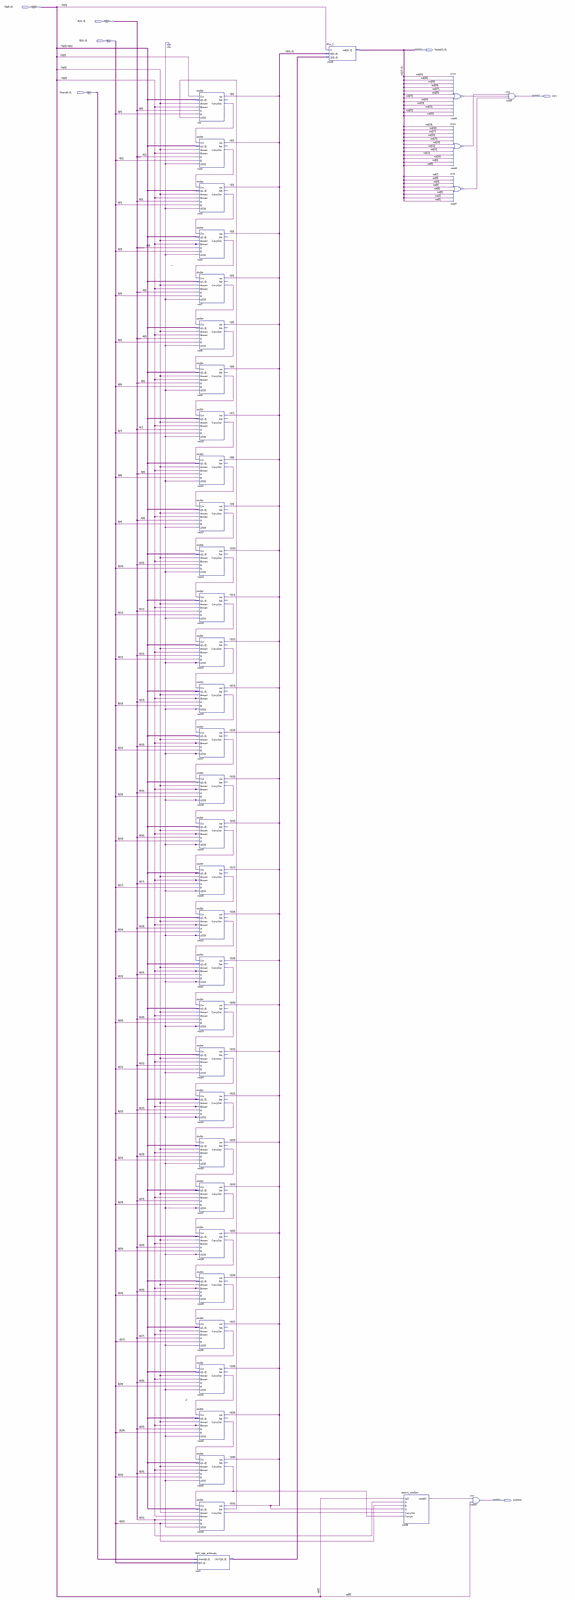
[diagram p0: schematic sheet, whole]
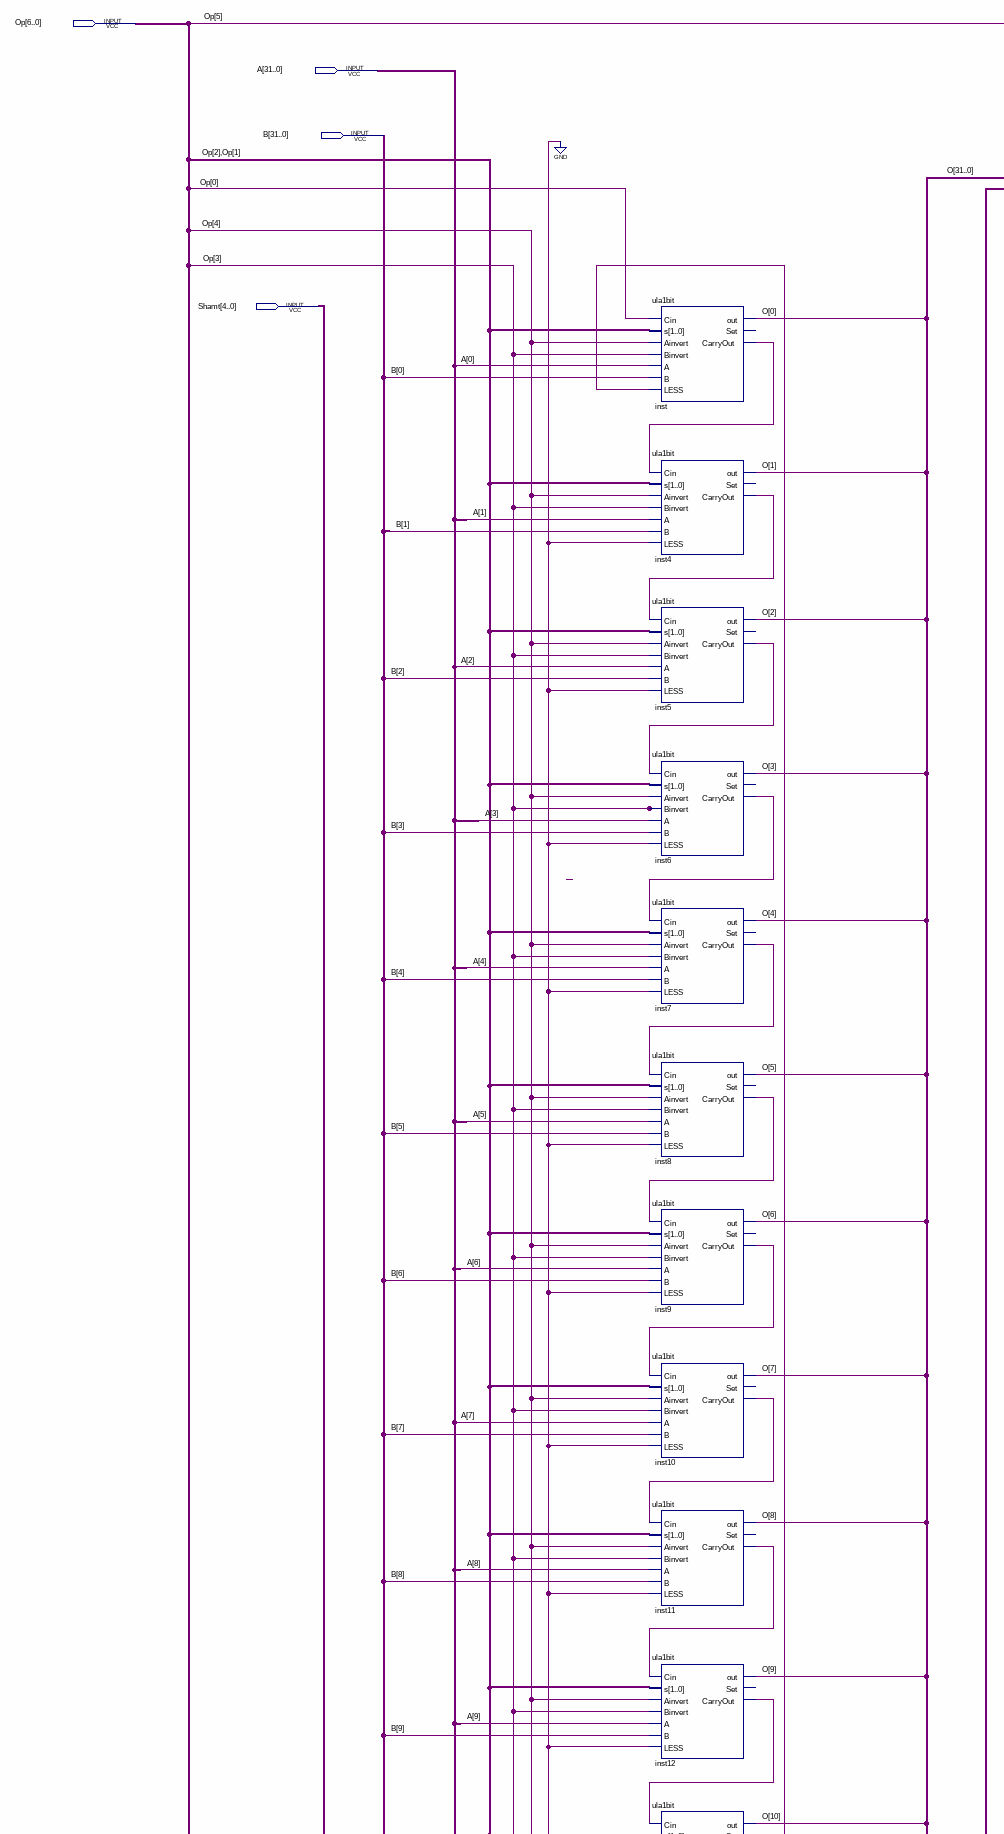
[diagram p1: schematic sheet, upper left part]
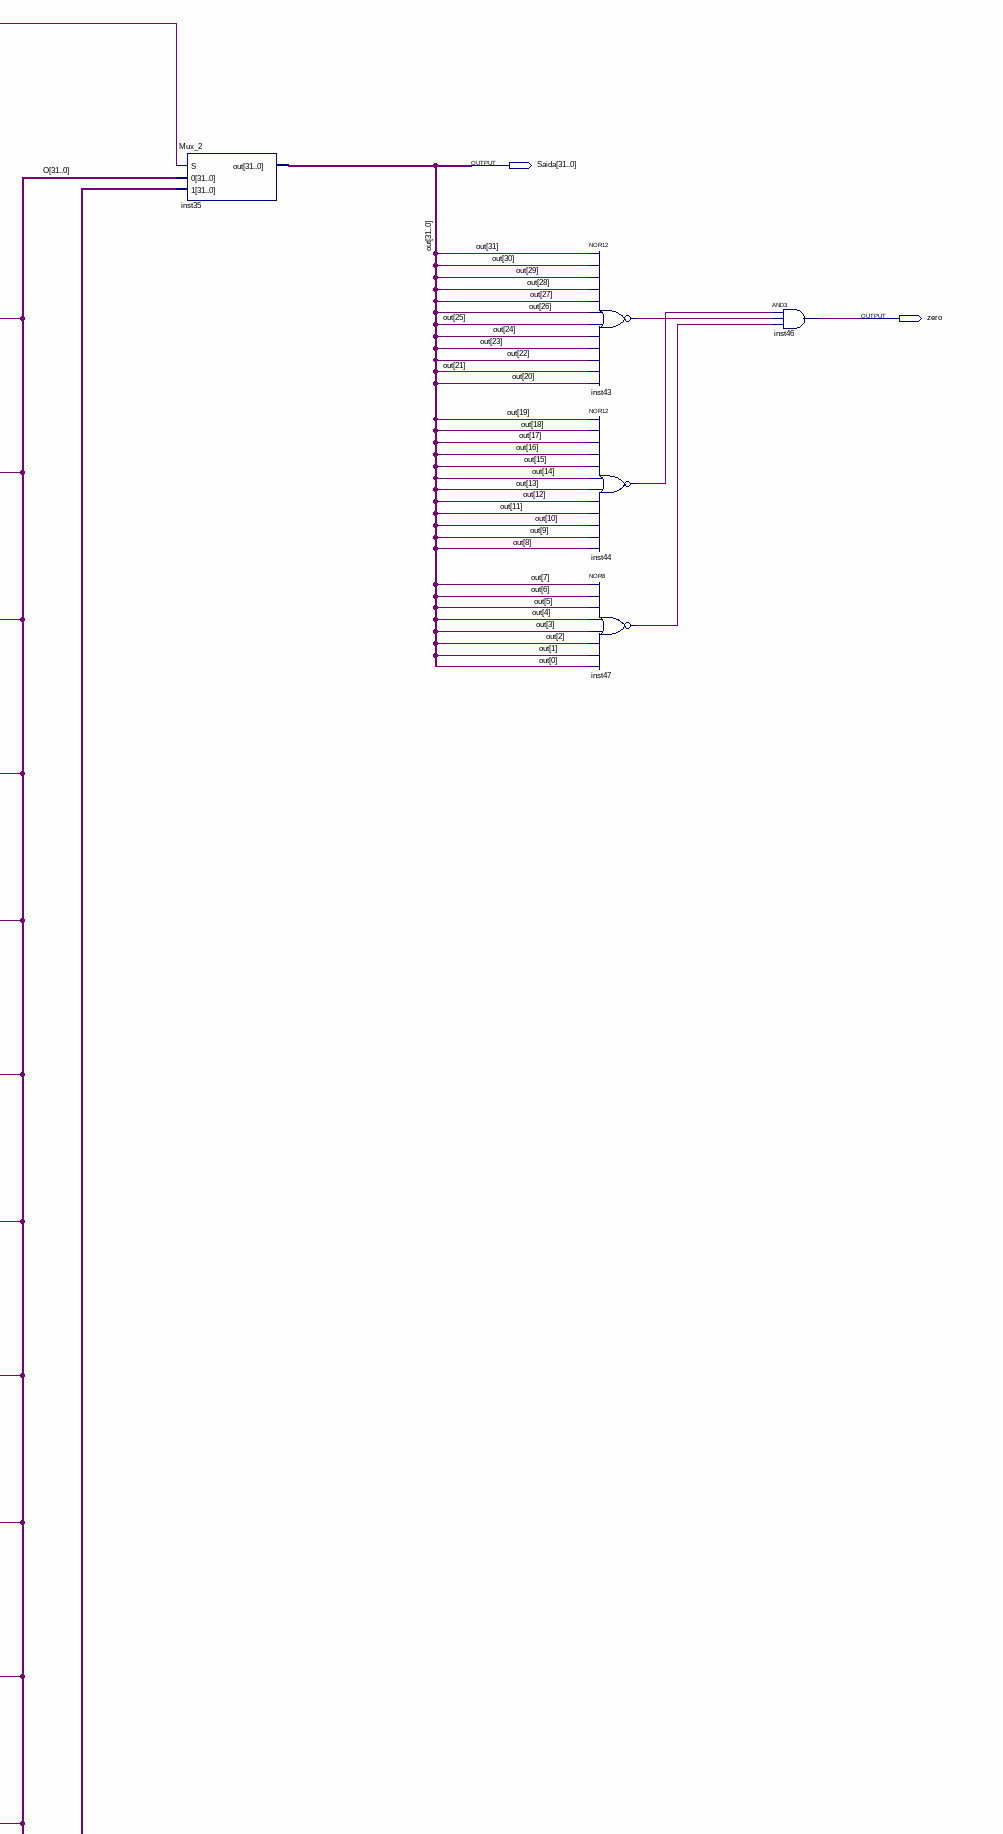
[diagram p2: schematic sheet, upper right part]
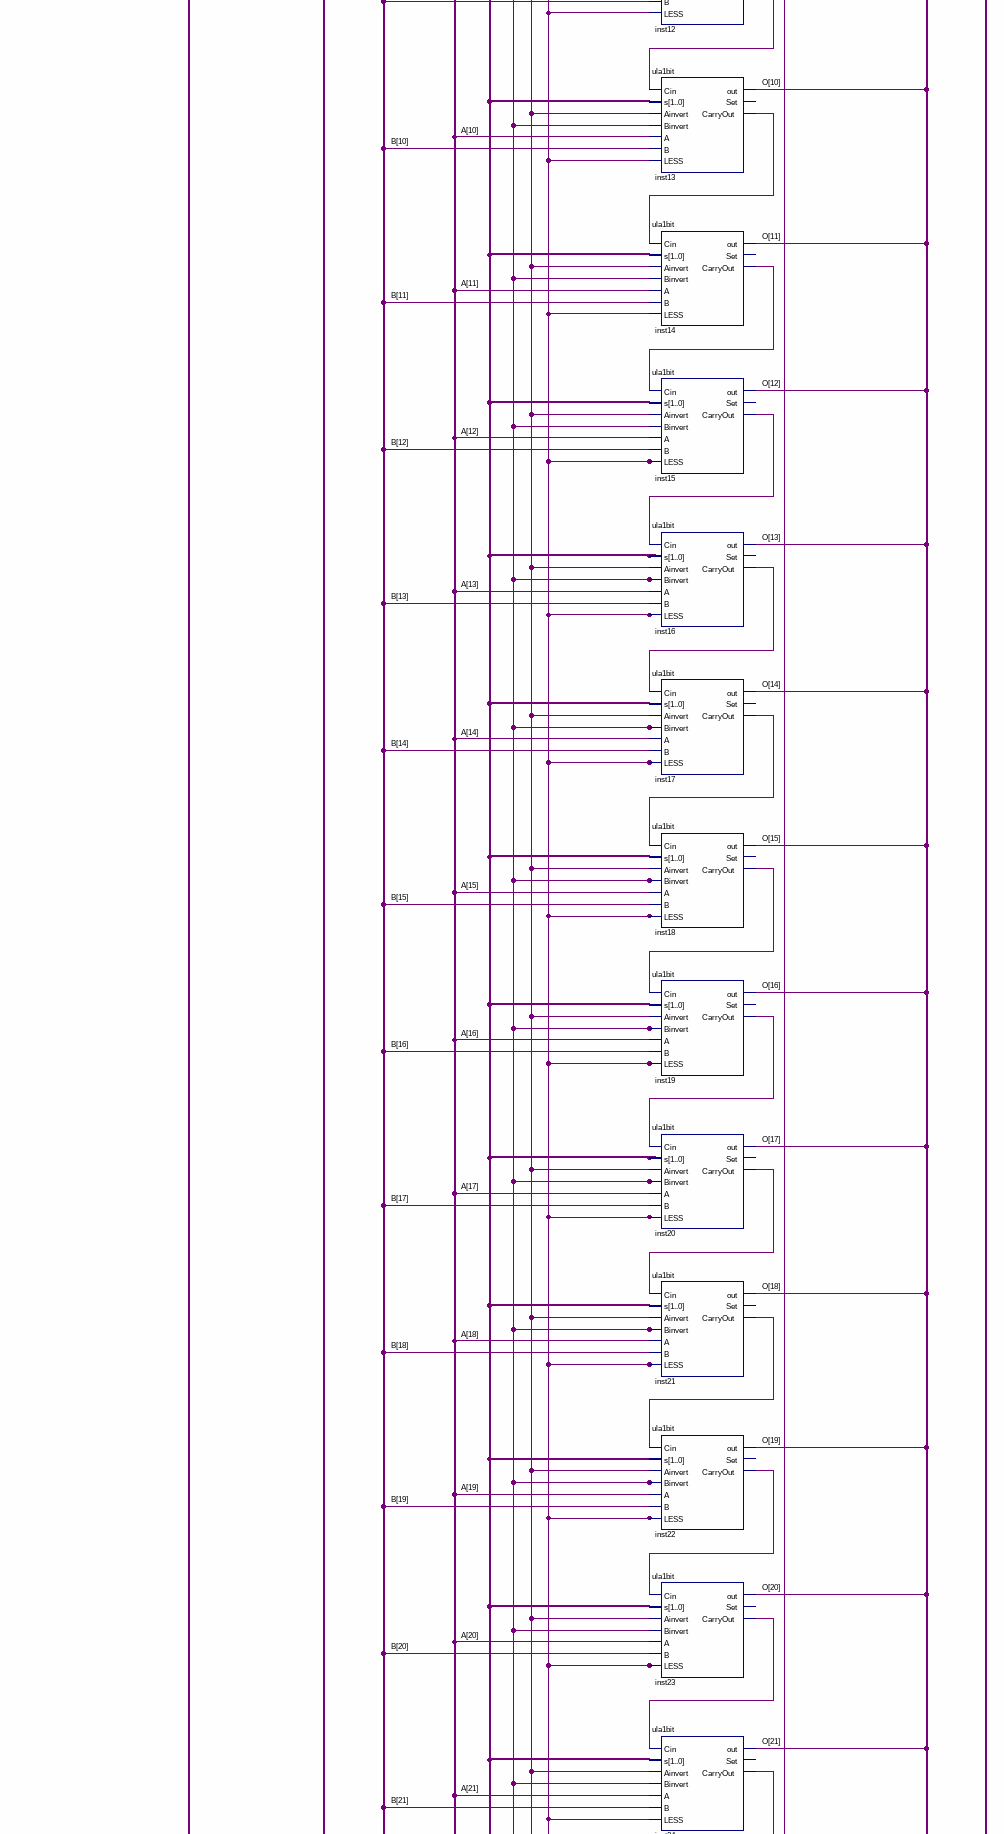
[diagram p3: schematic sheet, middle left part]
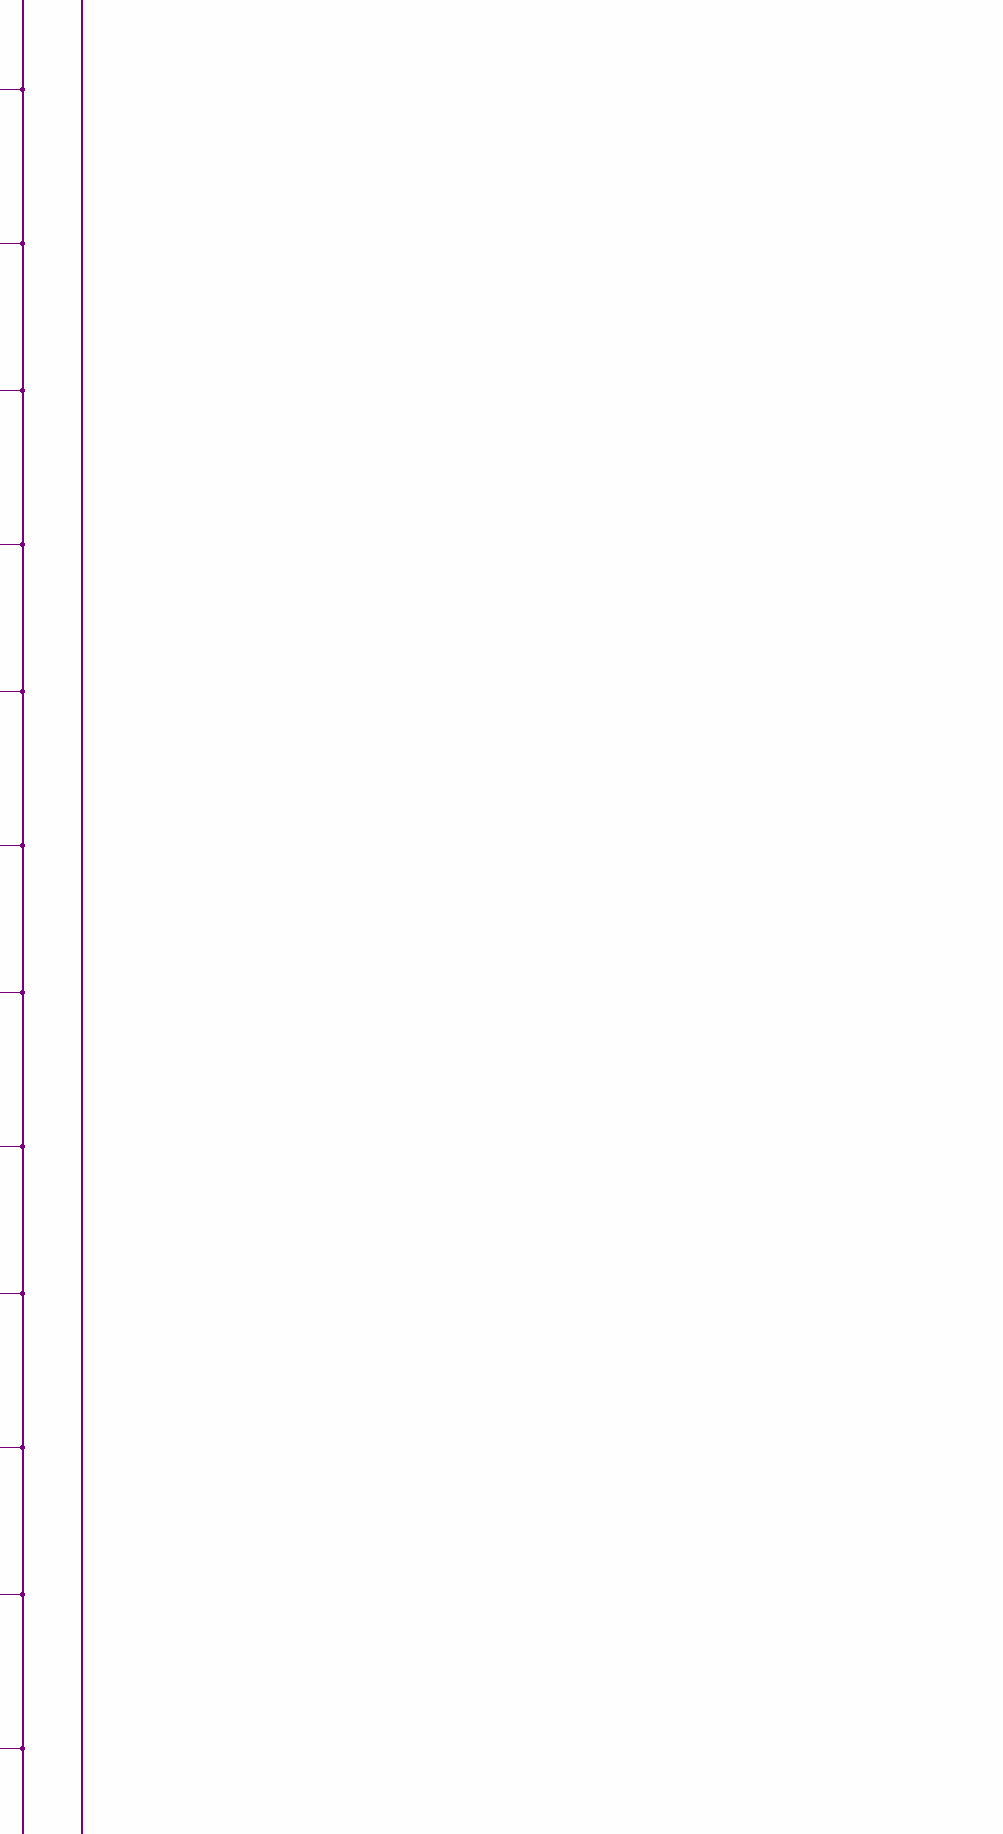
[diagram p4: schematic sheet, middle right part]
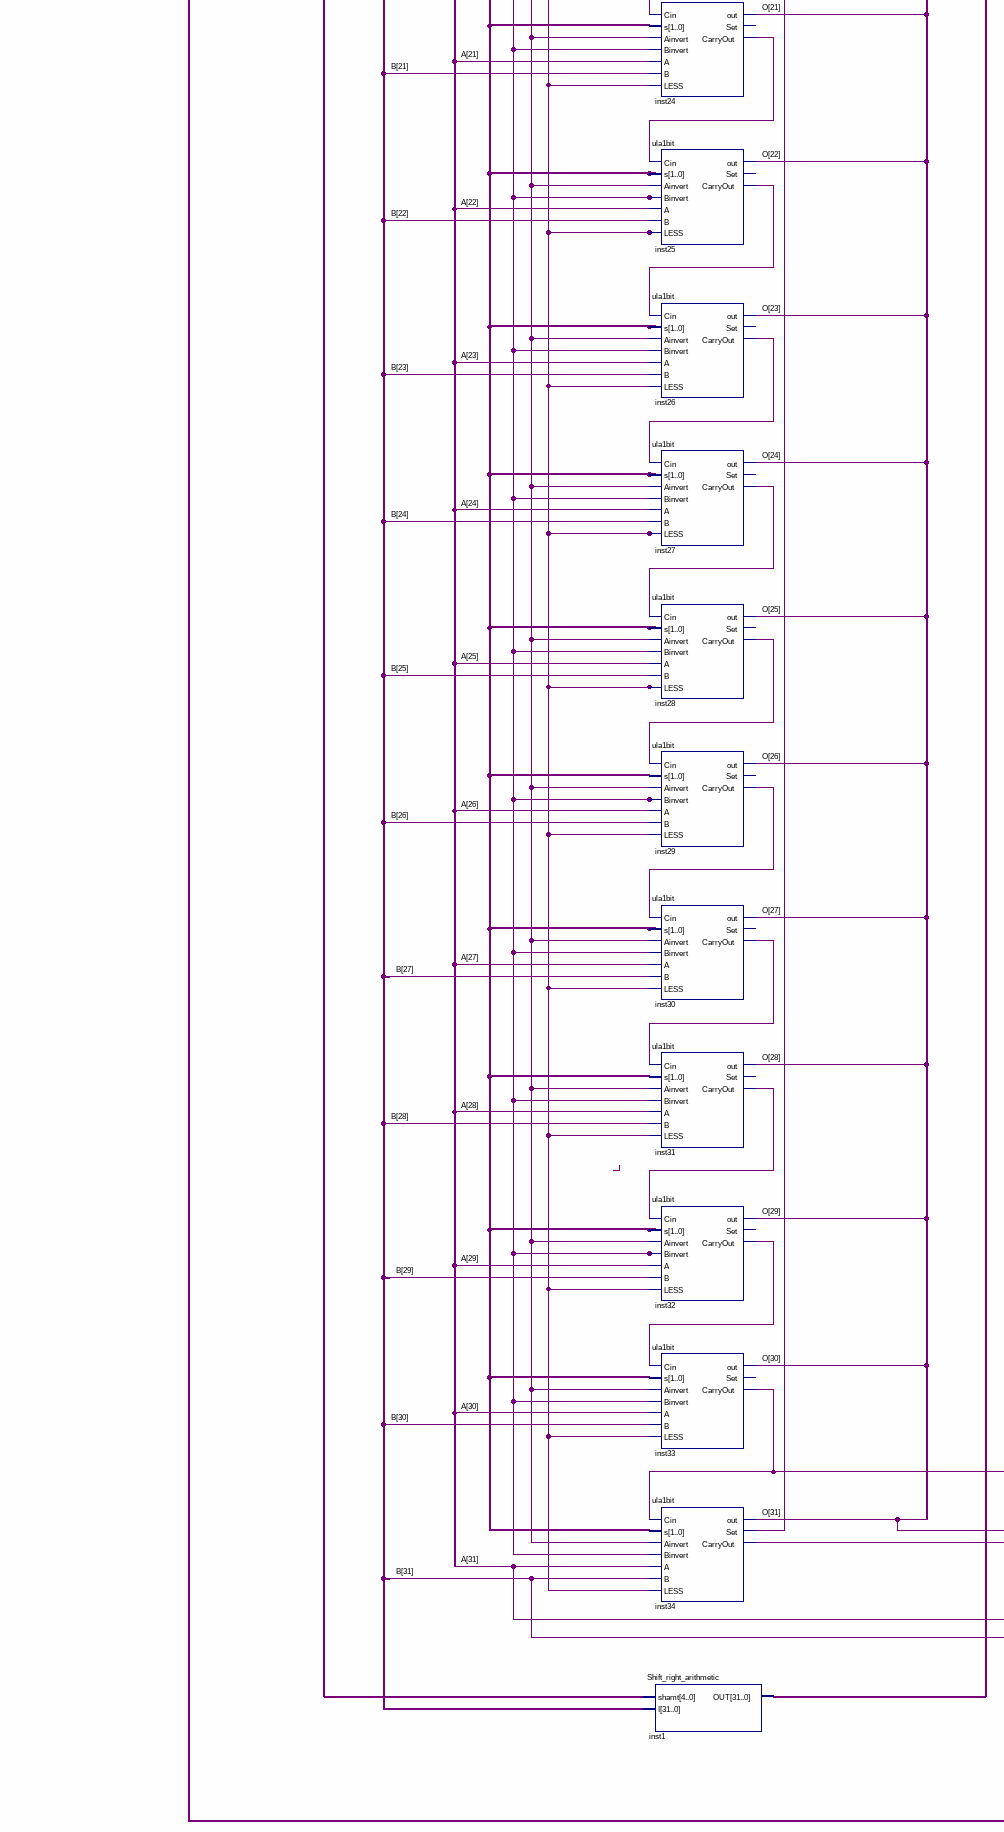
[diagram p5: schematic sheet, lower left part]
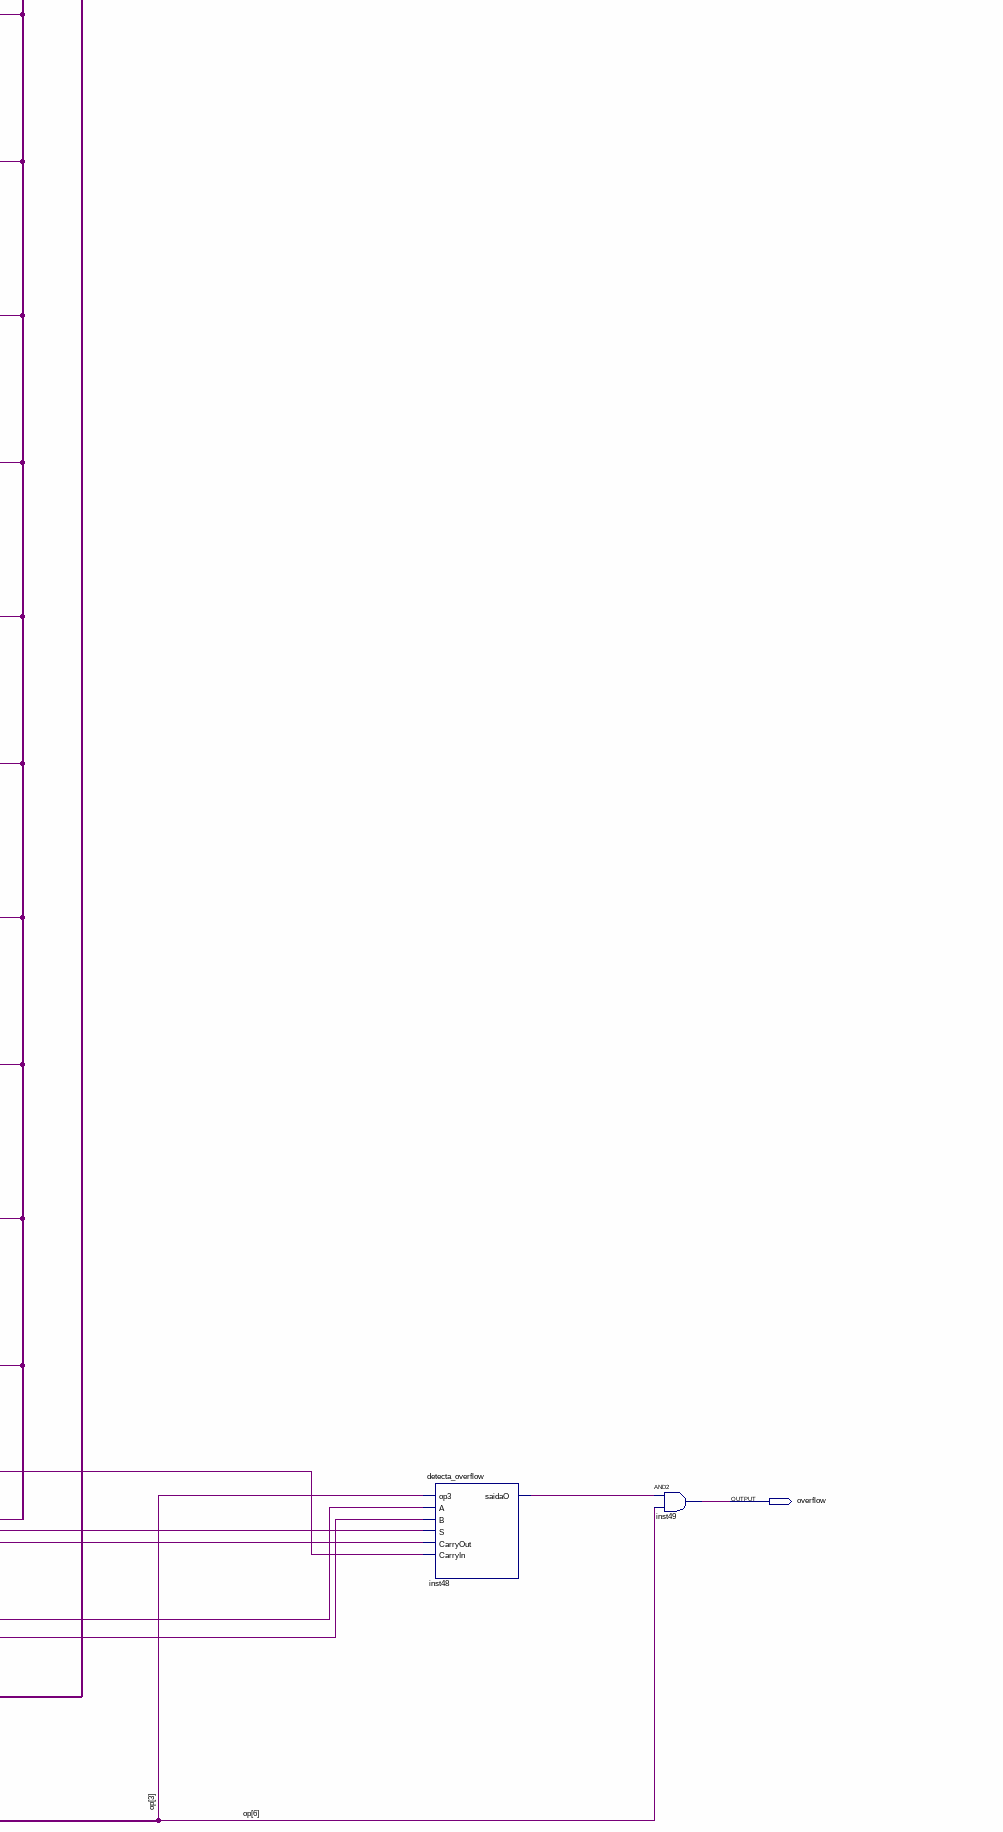
[diagram p6: schematic sheet, lower right part]
// Quartus schematic Ula32bits.bdf as structural Verilog: 40 symbols, 7 pins
module Ula32bits (
  input  [6:0] Op,
  input  [31:0] A,
  input  [31:0] B,
  input  [4:0] Shamt,
  output [31:0] Saida,
  output zero,
  output overflow
);

  wire inst4_carryout, inst5_carryout, inst6_carryout, inst7_carryout, inst8_carryout, inst9_carryout,
       inst10_carryout, inst11_carryout, inst12_carryout, inst13_carryout, inst14_carryout, inst15_carryout,
       inst16_carryout, inst17_carryout, inst18_carryout, inst19_carryout, inst20_carryout, inst21_carryout,
       inst22_carryout, inst23_carryout, inst24_carryout, inst25_carryout, inst26_carryout, inst27_carryout,
       inst28_carryout, inst29_carryout, inst30_carryout, inst31_carryout, inst32_carryout, inst33_carryout,
       inst34_carryout, inst34_set, inst43_out, inst44_out, inst47_out, inst48_saidao, inst_carryout;
  wire [31:0] inst1_out, O;

  ula1bit inst (
    .Cin(Op[0]), .s(Op[2:1]), .Ainvert(Op[4]), .Binvert(Op[3]), .A(A[0]), .B(B[0]), .LESS(inst34_set),
    .out(O[0]), .CarryOut(inst_carryout));  // open: Set
  ula1bit inst4 (
    .Cin(inst_carryout), .s(Op[2:1]), .Ainvert(Op[4]), .Binvert(Op[3]), .A(A[1]), .B(B[1]), .LESS(1'b0),
    .out(O[1]), .CarryOut(inst4_carryout));  // open: Set
  ula1bit inst5 (
    .Cin(inst4_carryout), .s(Op[2:1]), .Ainvert(Op[4]), .Binvert(Op[3]), .A(A[2]), .B(B[2]), .LESS(1'b0),
    .out(O[2]), .CarryOut(inst5_carryout));  // open: Set
  ula1bit inst6 (
    .Cin(inst5_carryout), .s(Op[2:1]), .Ainvert(Op[4]), .Binvert(Op[3]), .A(A[3]), .B(B[3]), .LESS(1'b0),
    .out(O[3]), .CarryOut(inst6_carryout));  // open: Set
  ula1bit inst7 (
    .Cin(inst6_carryout), .s(Op[2:1]), .Ainvert(Op[4]), .Binvert(Op[3]), .A(A[4]), .B(B[4]), .LESS(1'b0),
    .out(O[4]), .CarryOut(inst7_carryout));  // open: Set
  ula1bit inst8 (
    .Cin(inst7_carryout), .s(Op[2:1]), .Ainvert(Op[4]), .Binvert(Op[3]), .A(A[5]), .B(B[5]), .LESS(1'b0),
    .out(O[5]), .CarryOut(inst8_carryout));  // open: Set
  ula1bit inst9 (
    .Cin(inst8_carryout), .s(Op[2:1]), .Ainvert(Op[4]), .Binvert(Op[3]), .A(A[6]), .B(B[6]), .LESS(1'b0),
    .out(O[6]), .CarryOut(inst9_carryout));  // open: Set
  ula1bit inst10 (
    .Cin(inst9_carryout), .s(Op[2:1]), .Ainvert(Op[4]), .Binvert(Op[3]), .A(A[7]), .B(B[7]), .LESS(1'b0),
    .out(O[7]), .CarryOut(inst10_carryout));  // open: Set
  ula1bit inst11 (
    .Cin(inst10_carryout), .s(Op[2:1]), .Ainvert(Op[4]), .Binvert(Op[3]), .A(A[8]), .B(B[8]), .LESS(1'b0),
    .out(O[8]), .CarryOut(inst11_carryout));  // open: Set
  ula1bit inst12 (
    .Cin(inst11_carryout), .s(Op[2:1]), .Ainvert(Op[4]), .Binvert(Op[3]), .A(A[9]), .B(B[9]), .LESS(1'b0),
    .out(O[9]), .CarryOut(inst12_carryout));  // open: Set
  ula1bit inst13 (
    .Cin(inst12_carryout), .s(Op[2:1]), .Ainvert(Op[4]), .Binvert(Op[3]), .A(A[10]), .B(B[10]), .LESS(1'b0),
    .out(O[10]), .CarryOut(inst13_carryout));  // open: Set
  ula1bit inst14 (
    .Cin(inst13_carryout), .s(Op[2:1]), .Ainvert(Op[4]), .Binvert(Op[3]), .A(A[11]), .B(B[11]), .LESS(1'b0),
    .out(O[11]), .CarryOut(inst14_carryout));  // open: Set
  ula1bit inst15 (
    .Cin(inst14_carryout), .s(Op[2:1]), .Ainvert(Op[4]), .Binvert(Op[3]), .A(A[12]), .B(B[12]), .LESS(1'b0),
    .out(O[12]), .CarryOut(inst15_carryout));  // open: Set
  ula1bit inst16 (
    .Cin(inst15_carryout), .s(Op[2:1]), .Ainvert(Op[4]), .Binvert(Op[3]), .A(A[13]), .B(B[13]), .LESS(1'b0),
    .out(O[13]), .CarryOut(inst16_carryout));  // open: Set
  ula1bit inst17 (
    .Cin(inst16_carryout), .s(Op[2:1]), .Ainvert(Op[4]), .Binvert(Op[3]), .A(A[14]), .B(B[14]), .LESS(1'b0),
    .out(O[14]), .CarryOut(inst17_carryout));  // open: Set
  ula1bit inst18 (
    .Cin(inst17_carryout), .s(Op[2:1]), .Ainvert(Op[4]), .Binvert(Op[3]), .A(A[15]), .B(B[15]), .LESS(1'b0),
    .out(O[15]), .CarryOut(inst18_carryout));  // open: Set
  ula1bit inst19 (
    .Cin(inst18_carryout), .s(Op[2:1]), .Ainvert(Op[4]), .Binvert(Op[3]), .A(A[16]), .B(B[16]), .LESS(1'b0),
    .out(O[16]), .CarryOut(inst19_carryout));  // open: Set
  ula1bit inst20 (
    .Cin(inst19_carryout), .s(Op[2:1]), .Ainvert(Op[4]), .Binvert(Op[3]), .A(A[17]), .B(B[17]), .LESS(1'b0),
    .out(O[17]), .CarryOut(inst20_carryout));  // open: Set
  ula1bit inst21 (
    .Cin(inst20_carryout), .s(Op[2:1]), .Ainvert(Op[4]), .Binvert(Op[3]), .A(A[18]), .B(B[18]), .LESS(1'b0),
    .out(O[18]), .CarryOut(inst21_carryout));  // open: Set
  ula1bit inst22 (
    .Cin(inst21_carryout), .s(Op[2:1]), .Ainvert(Op[4]), .Binvert(Op[3]), .A(A[19]), .B(B[19]), .LESS(1'b0),
    .out(O[19]), .CarryOut(inst22_carryout));  // open: Set
  ula1bit inst23 (
    .Cin(inst22_carryout), .s(Op[2:1]), .Ainvert(Op[4]), .Binvert(Op[3]), .A(A[20]), .B(B[20]), .LESS(1'b0),
    .out(O[20]), .CarryOut(inst23_carryout));  // open: Set
  ula1bit inst24 (
    .Cin(inst23_carryout), .s(Op[2:1]), .Ainvert(Op[4]), .Binvert(Op[3]), .A(A[21]), .B(B[21]), .LESS(1'b0),
    .out(O[21]), .CarryOut(inst24_carryout));  // open: Set
  ula1bit inst25 (
    .Cin(inst24_carryout), .s(Op[2:1]), .Ainvert(Op[4]), .Binvert(Op[3]), .A(A[22]), .B(B[22]), .LESS(1'b0),
    .out(O[22]), .CarryOut(inst25_carryout));  // open: Set
  ula1bit inst26 (
    .Cin(inst25_carryout), .s(Op[2:1]), .Ainvert(Op[4]), .Binvert(Op[3]), .A(A[23]), .B(B[23]), .LESS(1'b0),
    .out(O[23]), .CarryOut(inst26_carryout));  // open: Set
  ula1bit inst27 (
    .Cin(inst26_carryout), .s(Op[2:1]), .Ainvert(Op[4]), .Binvert(Op[3]), .A(A[24]), .B(B[24]), .LESS(1'b0),
    .out(O[24]), .CarryOut(inst27_carryout));  // open: Set
  ula1bit inst28 (
    .Cin(inst27_carryout), .s(Op[2:1]), .Ainvert(Op[4]), .Binvert(Op[3]), .A(A[25]), .B(B[25]), .LESS(1'b0),
    .out(O[25]), .CarryOut(inst28_carryout));  // open: Set
  ula1bit inst29 (
    .Cin(inst28_carryout), .s(Op[2:1]), .Ainvert(Op[4]), .Binvert(Op[3]), .A(A[26]), .B(B[26]), .LESS(1'b0),
    .out(O[26]), .CarryOut(inst29_carryout));  // open: Set
  ula1bit inst30 (
    .Cin(inst29_carryout), .s(Op[2:1]), .Ainvert(Op[4]), .Binvert(Op[3]), .A(A[27]), .B(B[27]), .LESS(1'b0),
    .out(O[27]), .CarryOut(inst30_carryout));  // open: Set
  ula1bit inst31 (
    .Cin(inst30_carryout), .s(Op[2:1]), .Ainvert(Op[4]), .Binvert(Op[3]), .A(A[28]), .B(B[28]), .LESS(1'b0),
    .out(O[28]), .CarryOut(inst31_carryout));  // open: Set
  ula1bit inst32 (
    .Cin(inst31_carryout), .s(Op[2:1]), .Ainvert(Op[4]), .Binvert(Op[3]), .A(A[29]), .B(B[29]), .LESS(1'b0),
    .out(O[29]), .CarryOut(inst32_carryout));  // open: Set
  ula1bit inst33 (
    .Cin(inst32_carryout), .s(Op[2:1]), .Ainvert(Op[4]), .Binvert(Op[3]), .A(A[30]), .B(B[30]), .LESS(1'b0),
    .out(O[30]), .CarryOut(inst33_carryout));  // open: Set
  ula1bit inst34 (
    .Cin(inst33_carryout), .s(Op[2:1]), .Ainvert(Op[4]), .Binvert(Op[3]), .A(A[31]), .B(B[31]), .LESS(1'b0),
    .out(O[31]), .Set(inst34_set), .CarryOut(inst34_carryout));
  Shift_right_arithmetic inst1 (.shamt(Shamt), .I(B), .OUT(inst1_out));
  Mux_2 inst35 (.S(Op[5]), .\0 (O), .\1 (inst1_out), .out(Saida));
  detecta_overflow inst48 (
    .op3(Op[3]), .A(A[31]), .B(B[31]), .S(O[31]), .CarryOut(inst34_carryout), .CarryIn(inst33_carryout),
    .saidaO(inst48_saidao));
  nor inst43 (inst43_out, Saida[31], Saida[30], Saida[29], Saida[28], Saida[27], Saida[26], Saida[25], Saida[24], Saida[23], Saida[22], Saida[21], Saida[20]);
  nor inst44 (inst44_out, Saida[19], Saida[18], Saida[17], Saida[16], Saida[15], Saida[14], Saida[13], Saida[12], Saida[11], Saida[10], Saida[9], Saida[8]);
  nor inst47 (inst47_out, Saida[7], Saida[6], Saida[5], Saida[4], Saida[3], Saida[2], Saida[1], Saida[0]);
  and inst49 (overflow, inst48_saidao, Op[6]);
  and inst46 (zero, inst44_out, inst43_out, inst47_out);

  // Other names for the same wires on the sheet: out[31:0] = Saida
endmodule
